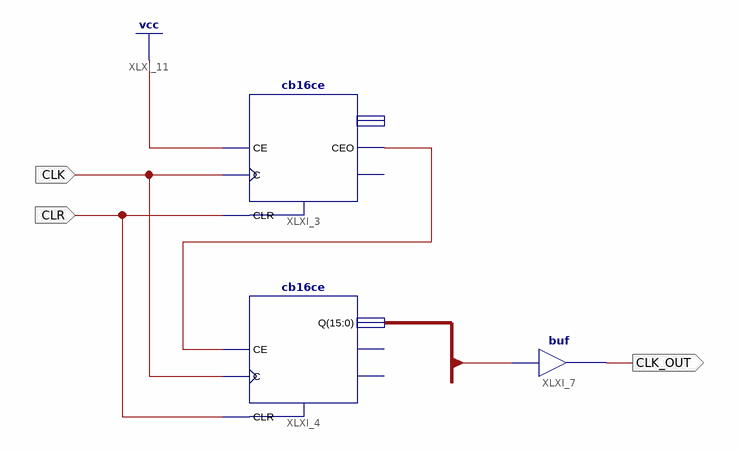
[diagram p0: schematic sheet 1]
// Xilinx ISE schematic clock_divider.sch (zynq) as structural Verilog: 3 symbols, 3 ports
module clock_divider (
  input  CLK,
  input  CLR,
  output CLK_OUT
);

  wire XLXN_1;
  wire [15:0] CNT;

  cb16ce XLXI_3 (.C(CLK), .CE(1'b1), .CLR(CLR), .CEO(XLXN_1));  // open: Q, TC
  cb16ce XLXI_4 (.C(CLK), .CE(XLXN_1), .CLR(CLR), .Q(CNT));  // open: CEO, TC
  buf XLXI_7 (CLK_OUT, CNT[6]);
endmodule
